# EAGLE schematic adapter_board (EAGLE 9.6.2)
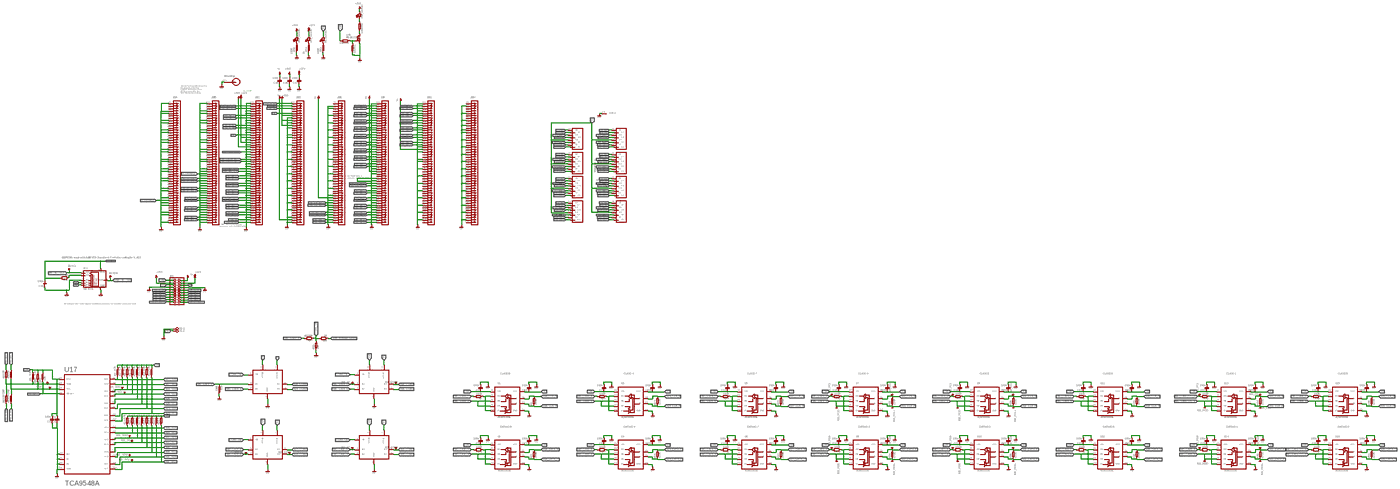
[diagram p0: schematic, sheet 1, overview]
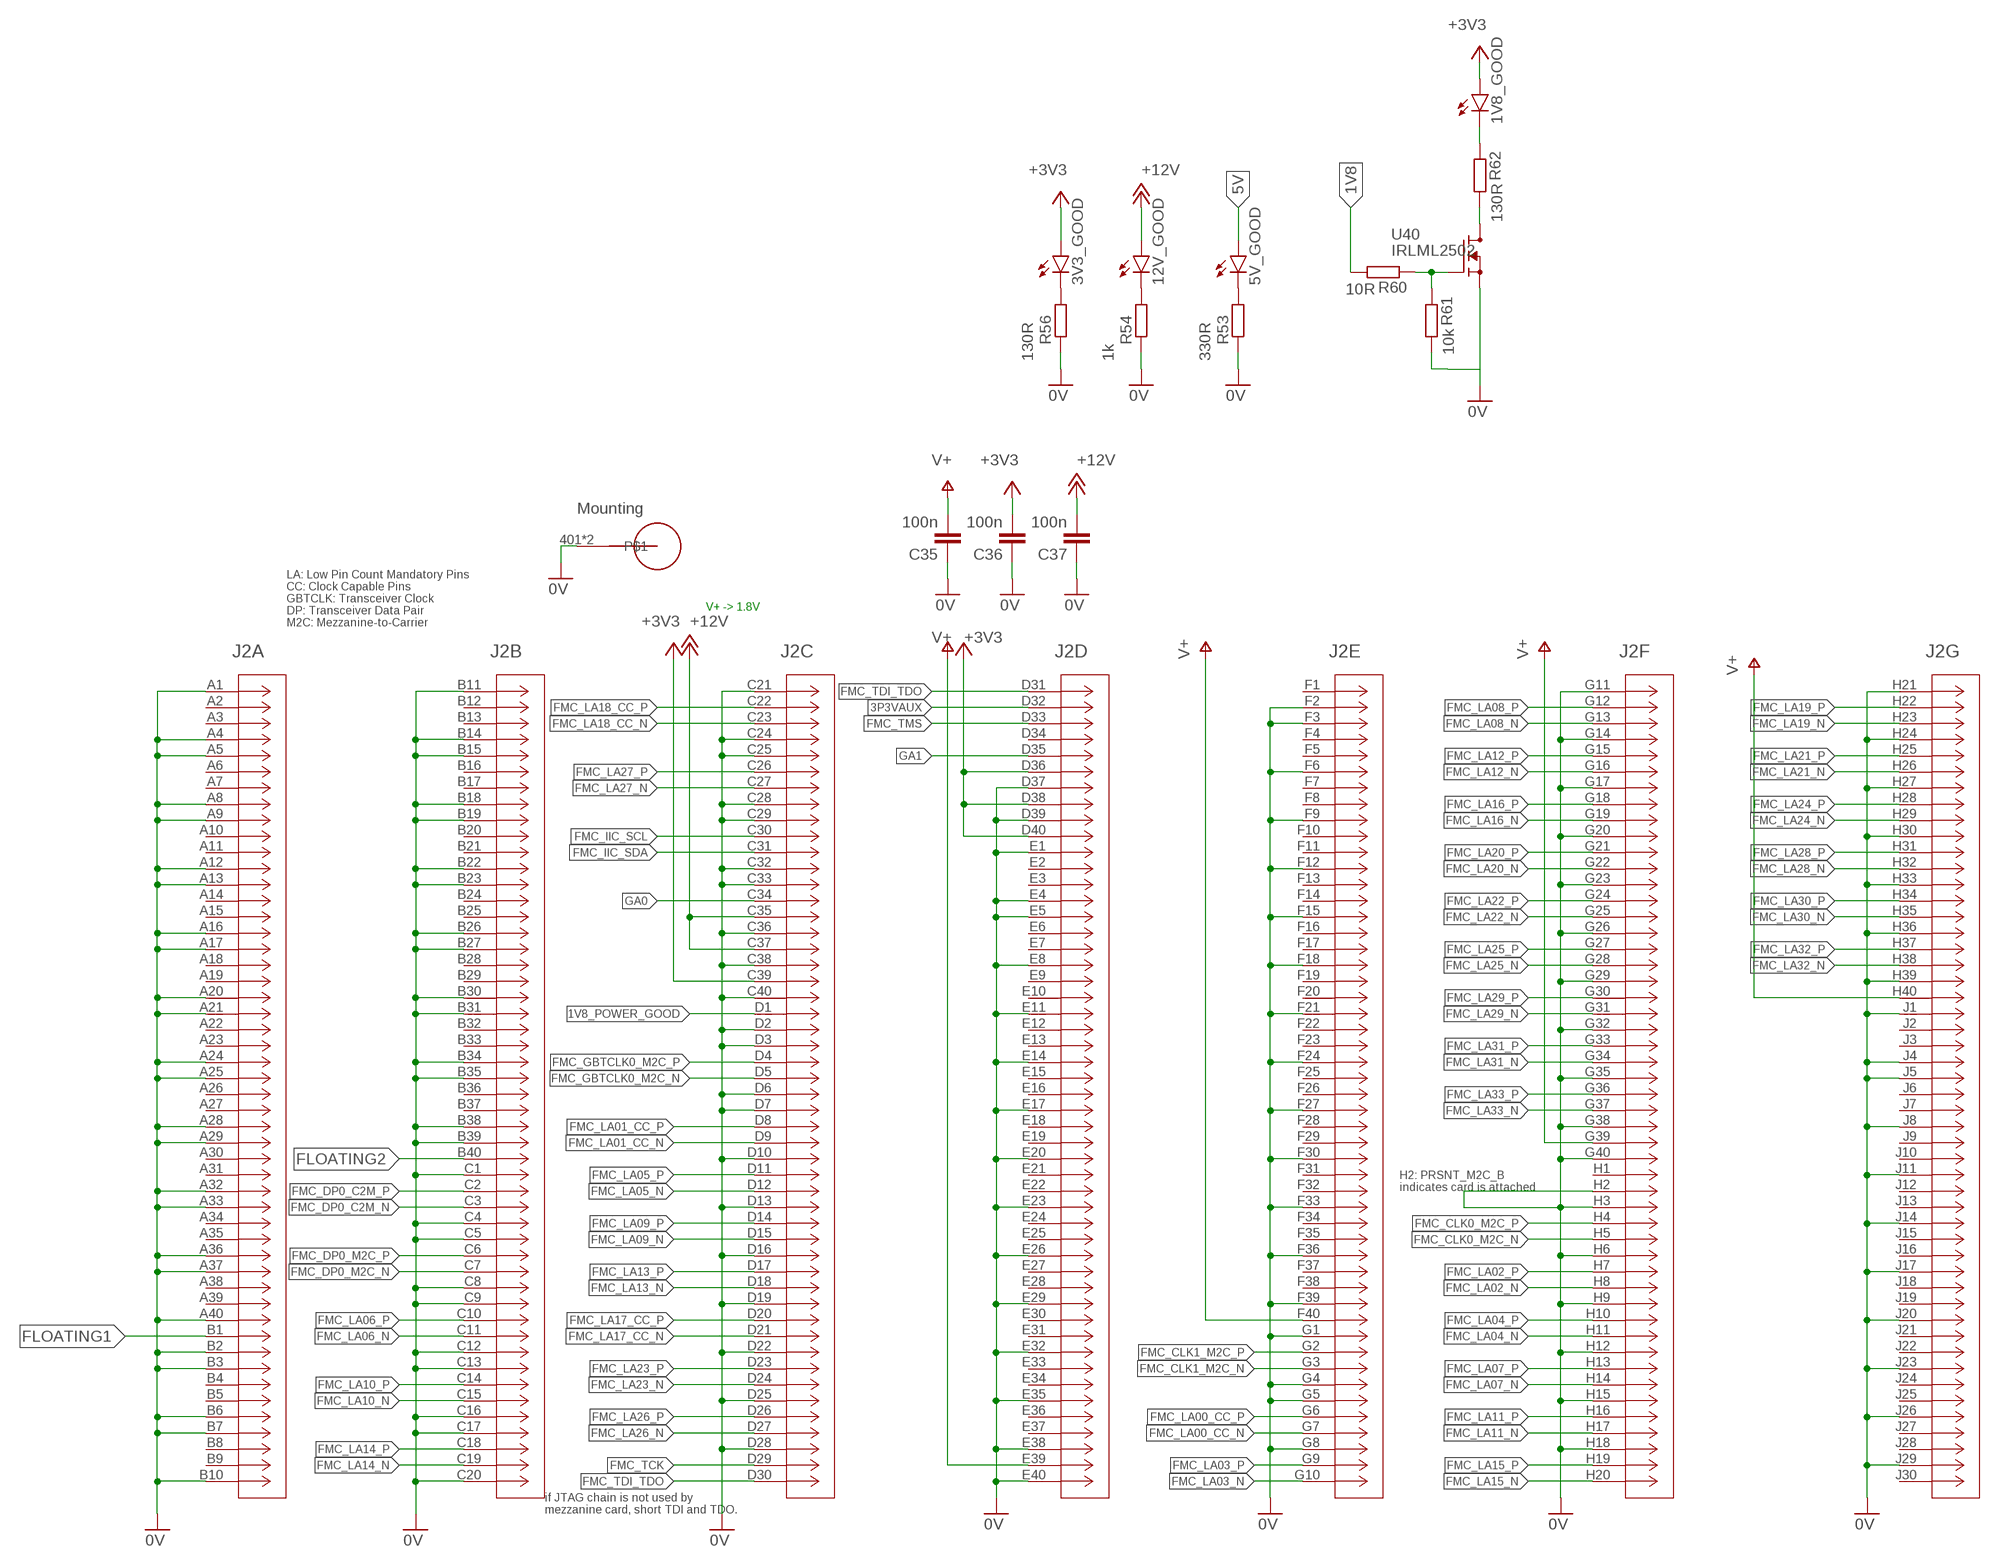
[diagram p1: schematic, sheet 1, part 1 of 5]
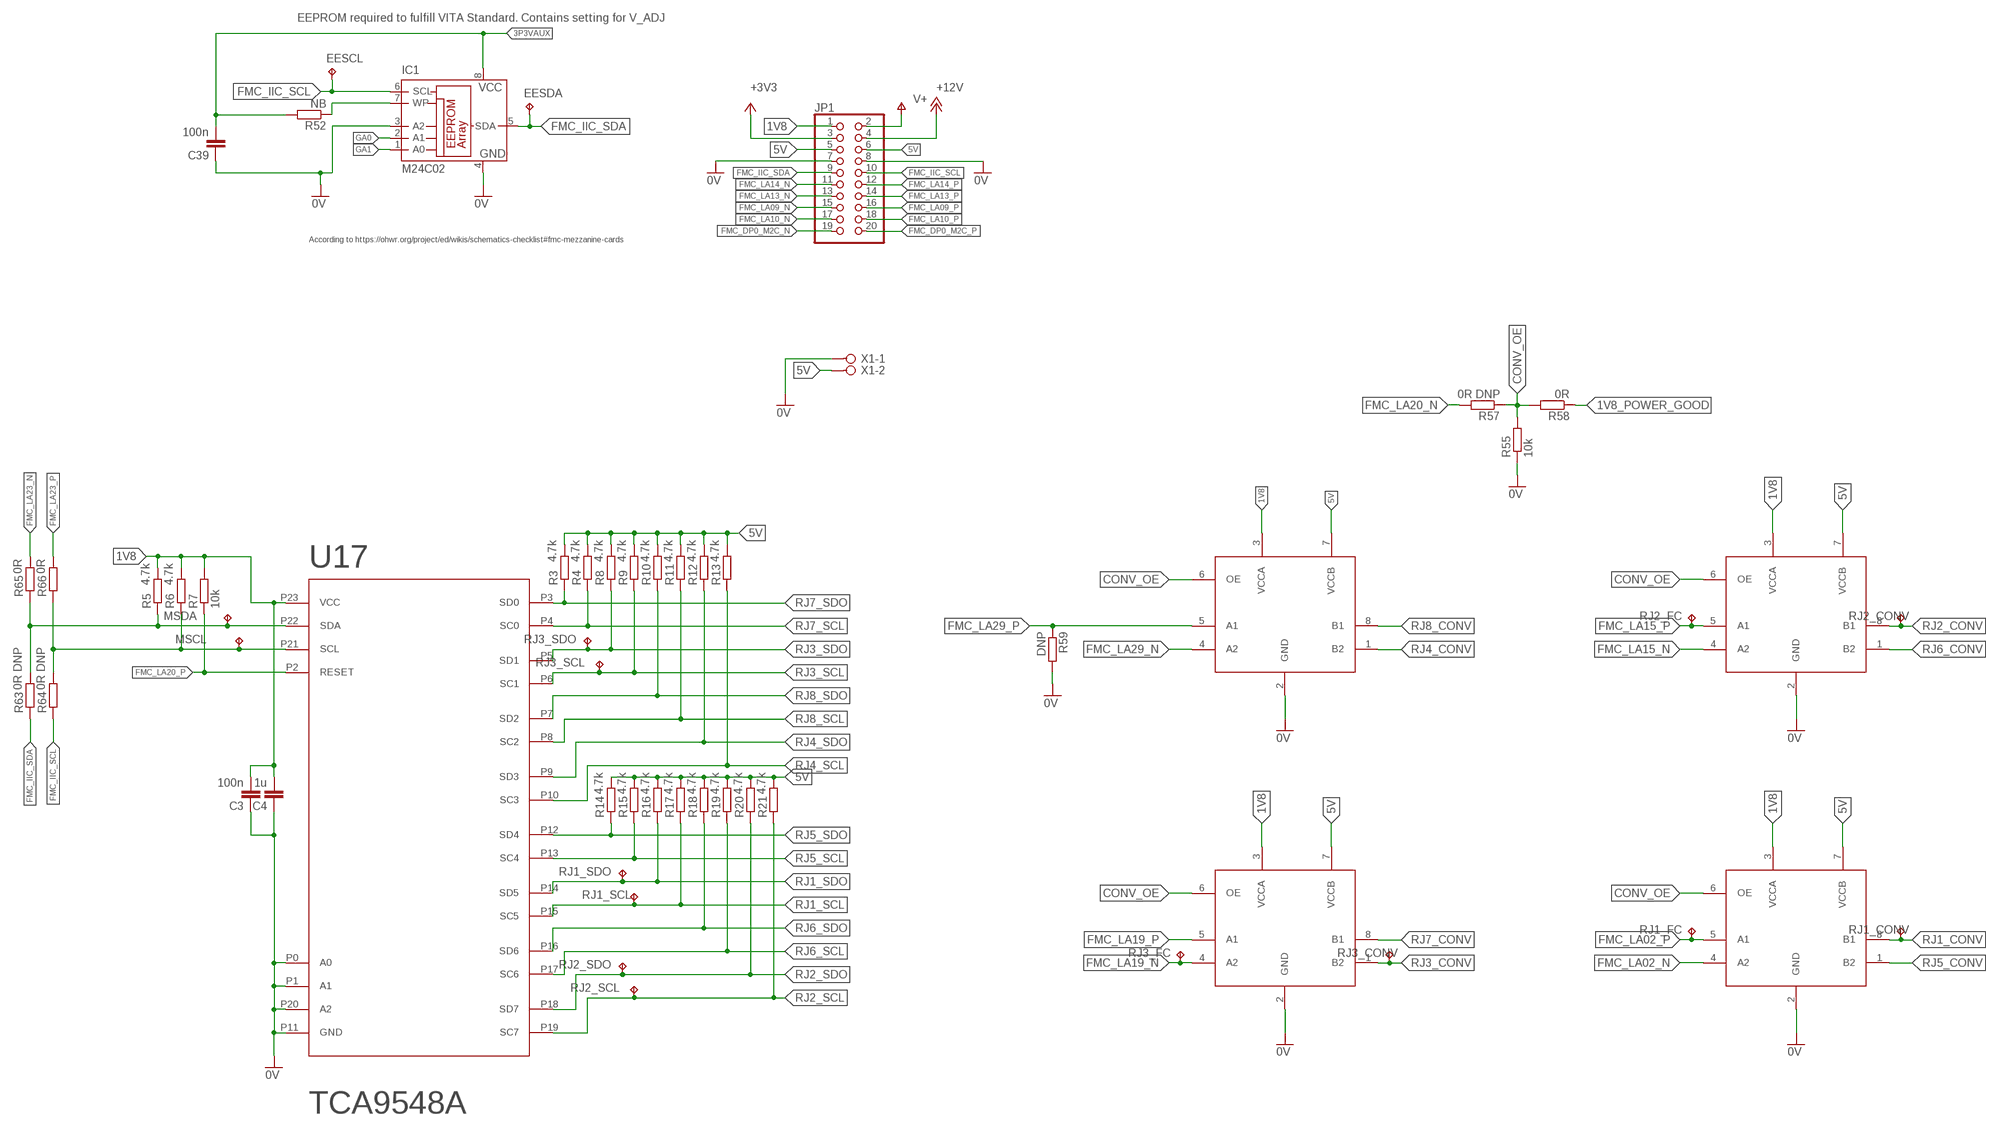
[diagram p2: schematic, sheet 1, part 2 of 5]
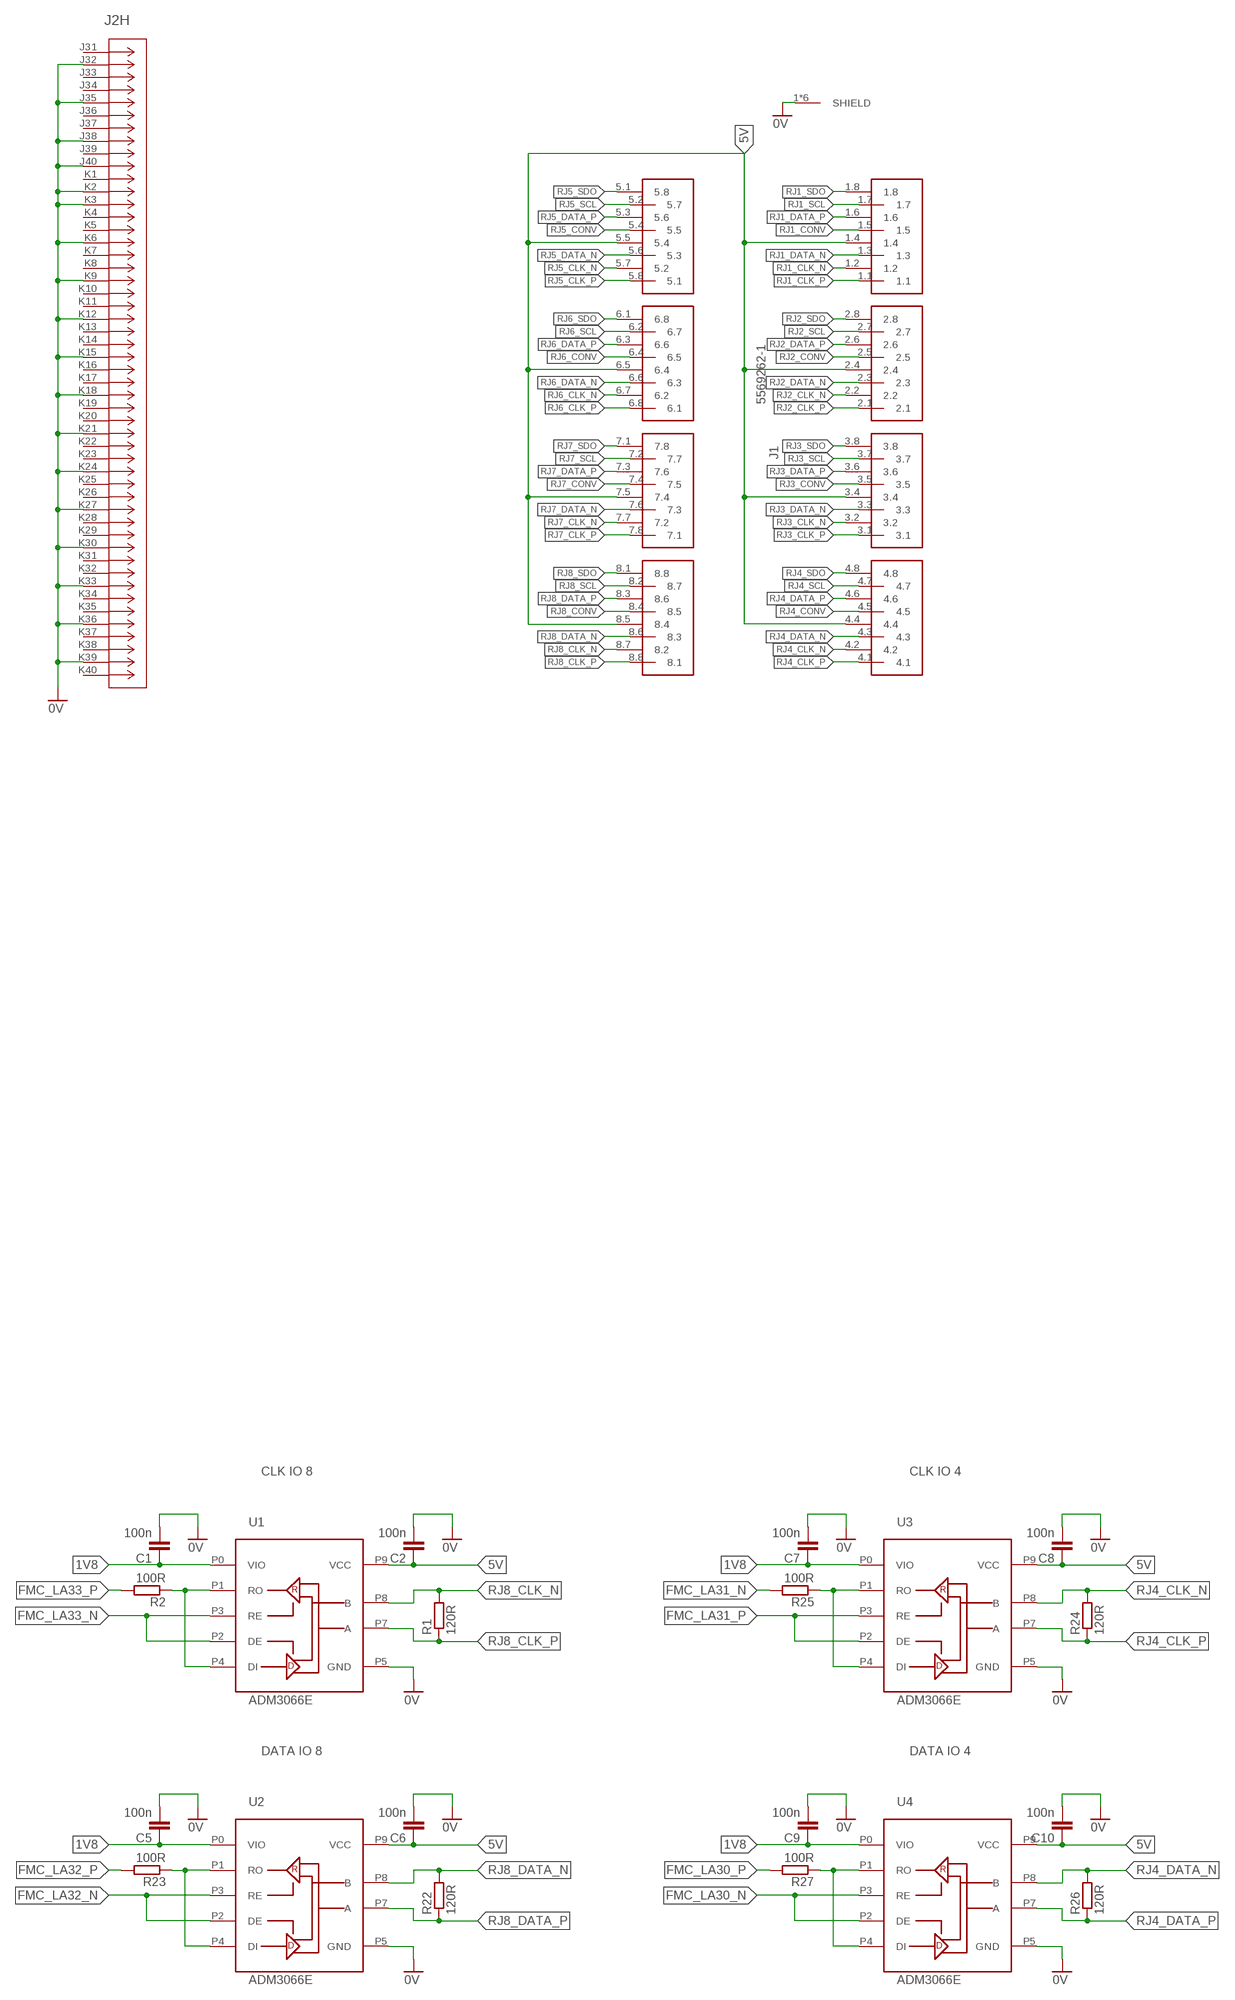
[diagram p3: schematic, sheet 1, part 3 of 5]
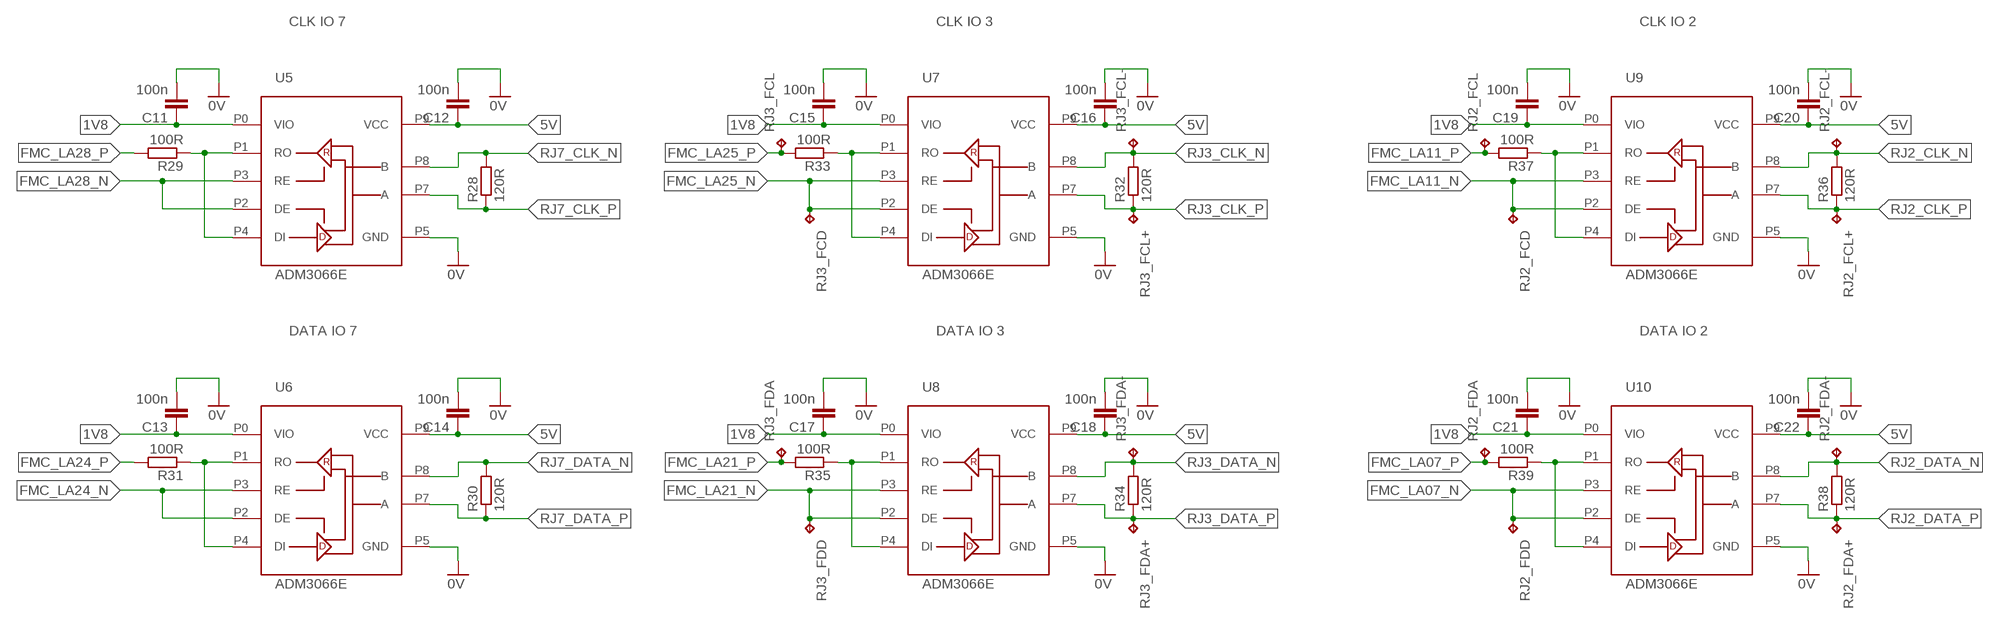
[diagram p4: schematic, sheet 1, part 4 of 5]
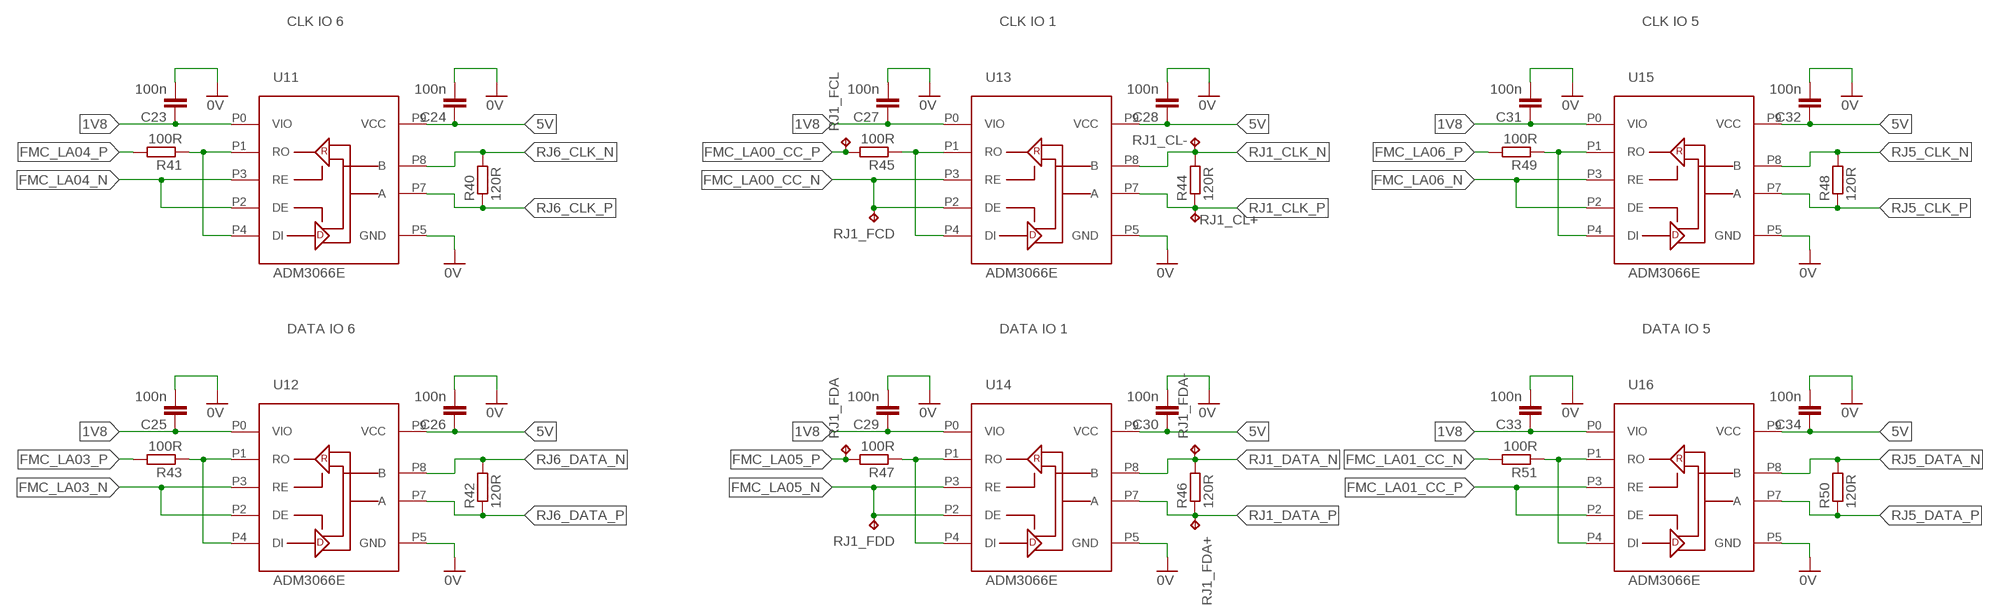
[diagram p5: schematic, sheet 1, part 5 of 5]

## Parts
1V8_GOOD  LEDCHIPLED_0805  [CHIPLED_0805]
3V3_GOOD  LEDCHIPLED_0805  [CHIPLED_0805]
5V_GOOD  LEDCHIPLED_0805  [CHIPLED_0805]
12V_GOOD  LEDCHIPLED_0805  [CHIPLED_0805]
C1  100n  C-EUC0603  [C0603]
C2  100n  C-EUC0603  [C0603]
C3  100n  C-EUC0805  [C0805]
C4  1u  C-EUC0805  [C0805]
C5  100n  C-EUC0603  [C0603]
C6  100n  C-EUC0603  [C0603]
C7  100n  C-EUC0603  [C0603]
C8  100n  C-EUC0603  [C0603]
C9  100n  C-EUC0603  [C0603]
C10  100n  C-EUC0603  [C0603]
C11  100n  C-EUC0603  [C0603]
C12  100n  C-EUC0603  [C0603]
C13  100n  C-EUC0603  [C0603]
C14  100n  C-EUC0603  [C0603]
C15  100n  C-EUC0603  [C0603]
C16  100n  C-EUC0603  [C0603]
C17  100n  C-EUC0603  [C0603]
C18  100n  C-EUC0603  [C0603]
C19  100n  C-EUC0603  [C0603]
C20  100n  C-EUC0603  [C0603]
C21  100n  C-EUC0603  [C0603]
C22  100n  C-EUC0603  [C0603]
C23  100n  C-EUC0603  [C0603]
C24  100n  C-EUC0603  [C0603]
C25  100n  C-EUC0603  [C0603]
C26  100n  C-EUC0603  [C0603]
C27  100n  C-EUC0603  [C0603]
C28  100n  C-EUC0603  [C0603]
C29  100n  C-EUC0603  [C0603]
C30  100n  C-EUC0603  [C0603]
C31  100n  C-EUC0603  [C0603]
C32  100n  C-EUC0603  [C0603]
C33  100n  C-EUC0603  [C0603]
C34  100n  C-EUC0603  [C0603]
C35  100n  C-EUC0603  [C0603]
C36  100n  C-EUC0603  [C0603]
C37  100n  C-EUC0603  [C0603]
C39  100n  C-EUC0603  [C0603]
EESCL  TPB1,27  [B1,27]
EESDA  TPB1,27  [B1,27]
IC1  M24C02  N24C02UDTGTSSOP8  [TSSOP-8]
J1  5569262-1  [TE_5569262-1]
J2  ASP-134488-01  [CONN_ASP-134488-01_SAI]
JP1  PINHD-2X10  [2X10]
MSCL  TPB1,27  [B1,27]
MSDA  TPB1,27  [B1,27]
R1  120R  R-EU_R0805  [R0805]
R2  100R  R-EU_R0603  [R0603]
R3  4.7k  R-EU_R0805  [R0805]
R4  4.7k  R-EU_R0805  [R0805]
R5  4.7k  R-EU_R0603  [R0603]
R6  4.7k  R-EU_R0603  [R0603]
R7  10k  R-EU_R0603  [R0603]
R8  4.7k  R-EU_R0805  [R0805]
R9  4.7k  R-EU_R0805  [R0805]
R10  4.7k  R-EU_R0805  [R0805]
R11  4.7k  R-EU_R0805  [R0805]
R12  4.7k  R-EU_R0805  [R0805]
R13  4.7k  R-EU_R0805  [R0805]
R14  4.7k  R-EU_R0805  [R0805]
R15  4.7k  R-EU_R0805  [R0805]
R16  4.7k  R-EU_R0805  [R0805]
R17  4.7k  R-EU_R0805  [R0805]
R18  4.7k  R-EU_R0805  [R0805]
R19  4.7k  R-EU_R0805  [R0805]
R20  4.7k  R-EU_R0805  [R0805]
R21  4.7k  R-EU_R0805  [R0805]
R22  120R  R-EU_R0805  [R0805]
R23  100R  R-EU_R0603  [R0603]
R24  120R  R-EU_R0805  [R0805]
R25  100R  R-EU_R0603  [R0603]
R26  120R  R-EU_R0805  [R0805]
R27  100R  R-EU_R0603  [R0603]
R28  120R  R-EU_R0805  [R0805]
R29  100R  R-EU_R0603  [R0603]
R30  120R  R-EU_R0805  [R0805]
R31  100R  R-EU_R0603  [R0603]
R32  120R  R-EU_R0805  [R0805]
R33  100R  R-EU_R0603  [R0603]
R34  120R  R-EU_R0805  [R0805]
R35  100R  R-EU_R0603  [R0603]
R36  120R  R-EU_R0805  [R0805]
R37  100R  R-EU_R0603  [R0603]
R38  120R  R-EU_R0805  [R0805]
R39  100R  R-EU_R0603  [R0603]
R40  120R  R-EU_R0805  [R0805]
R41  100R  R-EU_R0603  [R0603]
R42  120R  R-EU_R0805  [R0805]
R43  100R  R-EU_R0603  [R0603]
R44  120R  R-EU_R0805  [R0805]
R45  100R  R-EU_R0603  [R0603]
R46  120R  R-EU_R0805  [R0805]
R47  100R  R-EU_R0603  [R0603]
R48  120R  R-EU_R0805  [R0805]
R49  100R  R-EU_R0603  [R0603]
R50  120R  R-EU_R0805  [R0805]
R51  100R  R-EU_R0603  [R0603]
R52  NB  R-EU_R0603  [R0603]
R53  330R  R-EU_R0805  [R0805]
R54  1k  R-EU_R0805  [R0805]
R55  10k  R-EU_R0603  [R0603]
R56  130R  R-EU_R0805  [R0805]
R57  0R DNP  R-EU_R0603  [R0603]
R58  0R  R-EU_R0603  [R0603]
R59  DNP  R-EU_R0805  [R0805]
R60  10R  R-EU_R0603  [R0603]
R61  10k  R-EU_R0603  [R0603]
R62  130R  R-EU_R0805  [R0805]
R63  0R DNP  R-EU_R0805  [R0805]
R64  0R DNP  R-EU_R0805  [R0805]
R65  0R  R-EU_R0805  [R0805]
R66  0R  R-EU_R0805  [R0805]
RJ1_CL+  TPB1,27  [B1,27]
RJ1_CL-  TPB1,27  [B1,27]
RJ1_CONV  TPB1,27  [B1,27]
RJ1_FC  TPB1,27  [B1,27]
RJ1_FCD  TPB1,27  [B1,27]
RJ1_FCL  TPB1,27  [B1,27]
RJ1_FDA  TPB1,27  [B1,27]
RJ1_FDA+  TPB1,27  [B1,27]
RJ1_FDA-  TPB1,27  [B1,27]
RJ1_FDD  TPB1,27  [B1,27]
RJ1_SCL  TPB1,27  [B1,27]
RJ1_SDO  TPB1,27  [B1,27]
RJ2_CONV  TPB1,27  [B1,27]
RJ2_FC  TPB1,27  [B1,27]
RJ2_FCD  TPB1,27  [B1,27]
RJ2_FCL  TPB1,27  [B1,27]
RJ2_FCL+  TPB1,27  [B1,27]
RJ2_FCL-  TPB1,27  [B1,27]
RJ2_FDA  TPB1,27  [B1,27]
RJ2_FDA+  TPB1,27  [B1,27]
RJ2_FDA-  TPB1,27  [B1,27]
RJ2_FDD  TPB1,27  [B1,27]
RJ2_SCL  TPB1,27  [B1,27]
RJ2_SDO  TPB1,27  [B1,27]
RJ3_CONV  TPB1,27  [B1,27]
RJ3_FC  TPB1,27  [B1,27]
RJ3_FCD  TPB1,27  [B1,27]
RJ3_FCL  TPB1,27  [B1,27]
RJ3_FCL+  TPB1,27  [B1,27]
RJ3_FCL-  TPB1,27  [B1,27]
RJ3_FDA  TPB1,27  [B1,27]
RJ3_FDA+  TPB1,27  [B1,27]
RJ3_FDA-  TPB1,27  [B1,27]
RJ3_FDD  TPB1,27  [B1,27]
RJ3_SCL  TPB1,27  [B1,27]
RJ3_SDO  TPB1,27  [B1,27]
U1  ADM3066E  [MSOP-10]
U2  ADM3066E  [MSOP-10]
U3  ADM3066E  [MSOP-10]
U4  ADM3066E  [MSOP-10]
U5  ADM3066E  [MSOP-10]
U6  ADM3066E  [MSOP-10]
U7  ADM3066E  [MSOP-10]
U8  ADM3066E  [MSOP-10]
U9  ADM3066E  [MSOP-10]
U10  ADM3066E  [MSOP-10]
U11  ADM3066E  [MSOP-10]
U12  ADM3066E  [MSOP-10]
U13  ADM3066E  [MSOP-10]
U14  ADM3066E  [MSOP-10]
U15  ADM3066E  [MSOP-10]
U16  ADM3066E  [MSOP-10]
U17  TCA9548A  PCA9548A  [PCA9548]
U18  TXS0102  [VSSOP-8]
U19  TXS0102  [VSSOP-8]
U20  TXS0102  [VSSOP-8]
U21  TXS0102  [VSSOP-8]
U40  IRLML2502  [SOT23-IRLML]
X1  W237-02P  [W237-132]

## Nets
0V: C1.2 C2.2 C3.1 C4.1 C5.2 C6.2 C7.2 C8.2 C9.2 C10.2 C11.2 C12.2 C13.2 C14.2 C15.2 C16.2 C17.2 C18.2 C19.2 C20.2 C21.2 C22.2 C23.2 C24.2 C25.2 C26.2 C27.2 C28.2 C29.2 C30.2 C31.2 C32.2 C33.2 C34.2 C35.1 C36.1 C37.1 C39.1 IC1.3(A2) IC1.4(GND) J1.1(SHIELD) J1.2(SHIELD) J1.3(SHIELD) J1.4(SHIELD) J1.5(SHIELD) J1.6(SHIELD) J2.401 J2.402 J2.A1(A:A1) J2.A4(A:A4) J2.A5(A:A5) J2.A8(A:A8) J2.A9(A:A9) J2.A12(A:A12) J2.A13(A:A13) J2.A16(A:A16) J2.A17(A:A17) J2.A20(A:A20) J2.A21(A:A21) J2.A24(A:A24) J2.A25(A:A25) J2.A28(A:A28) J2.A29(A:A29) J2.A32(A:A32) J2.A33(A:A33) J2.A36(A:A36) J2.A37(A:A37) J2.A40(A:A40) J2.B2(A:B2) J2.B3(A:B3) J2.B6(A:B6) J2.B7(A:B7) J2.B10(A:B10) J2.B11(B:B11) J2.B14(B:B14) J2.B15(B:B15) J2.B18(B:B18) J2.B19(B:B19) J2.B22(B:B22) J2.B23(B:B23) J2.B26(B:B26) J2.B27(B:B27) J2.B30(B:B30) J2.B31(B:B31) J2.B34(B:B34) J2.B35(B:B35) J2.B38(B:B38) J2.B39(B:B39) J2.C1(B:C1) J2.C4(B:C4) J2.C5(B:C5) J2.C8(B:C8) J2.C9(B:C9) J2.C12(B:C12) J2.C13(B:C13) J2.C16(B:C16) J2.C17(B:C17) J2.C20(B:C20) J2.C21(C:C21) J2.C24(C:C24) J2.C25(C:C25) J2.C28(C:C28) J2.C29(C:C29) J2.C32(C:C32) J2.C33(C:C33) J2.C36(C:C36) J2.C38(C:C38) J2.C40(C:C40) J2.D2(C:D2) J2.D3(C:D3) J2.D6(C:D6) J2.D7(C:D7) J2.D10(C:D10) J2.D13(C:D13) J2.D16(C:D16) J2.D19(C:D19) J2.D22(C:D22) J2.D25(C:D25) J2.D28(C:D28) J2.D37(D:D37) J2.D39(D:D39) J2.E1(D:E1) J2.E4(D:E4) J2.E5(D:E5) J2.E8(D:E8) J2.E11(D:E11) J2.E14(D:E14) J2.E17(D:E17) J2.E20(D:E20) J2.E23(D:E23) J2.E26(D:E26) J2.E29(D:E29) J2.E32(D:E32) J2.E35(D:E35) J2.E38(D:E38) J2.E40(D:E40) J2.F2(E:F2) J2.F3(E:F3) J2.F6(E:F6) J2.F9(E:F9) J2.F12(E:F12) J2.F15(E:F15) J2.F18(E:F18) J2.F21(E:F21) J2.F24(E:F24) J2.F27(E:F27) J2.F30(E:F30) J2.F33(E:F33) J2.F36(E:F36) J2.F39(E:F39) J2.G1(E:G1) J2.G4(E:G4) J2.G5(E:G5) J2.G8(E:G8) J2.G11(F:G11) J2.G14(F:G14) J2.G17(F:G17) J2.G20(F:G20) J2.G23(F:G23) J2.G26(F:G26) J2.G29(F:G29) J2.G32(F:G32) J2.G35(F:G35) J2.G38(F:G38) J2.G40(F:G40) J2.H2(F:H2) J2.H3(F:H3) J2.H6(F:H6) J2.H9(F:H9) J2.H12(F:H12) J2.H15(F:H15) J2.H18(F:H18) J2.H21(G:H21) J2.H24(G:H24) J2.H27(G:H27) J2.H30(G:H30) J2.H33(G:H33) J2.H36(G:H36) J2.H39(G:H39) J2.J1(G:J1) J2.J4(G:J4) J2.J5(G:J5) J2.J8(G:J8) J2.J11(G:J11) J2.J14(G:J14) J2.J17(G:J17) J2.J20(G:J20) J2.J23(G:J23) J2.J26(G:J26) J2.J29(G:J29) J2.J32(H:J32) J2.J35(H:J35) J2.J38(H:J38) J2.J40(H:J40) J2.K2(H:K2) J2.K3(H:K3) J2.K6(H:K6) J2.K9(H:K9) J2.K12(H:K12) J2.K15(H:K15) J2.K18(H:K18) J2.K21(H:K21) J2.K24(H:K24) J2.K27(H:K27) J2.K30(H:K30) J2.K33(H:K33) J2.K36(H:K36) J2.K39(H:K39) JP1.7 JP1.8 R53.1 R54.1 R55.1 R56.1 R59.2 R61.2 U1.P5(GND) U2.P5(GND) U3.P5(GND) U4.P5(GND) U5.P5(GND) U6.P5(GND) U7.P5(GND) U8.P5(GND) U9.P5(GND) U10.P5(GND) U11.P5(GND) U12.P5(GND) U13.P5(GND) U14.P5(GND) U15.P5(GND) U16.P5(GND) U17.P0(A0) U17.P1(A1) U17.P11(GND) U17.P20(A2) U18.2(GND) U19.2(GND) U20.2(GND) U21.2(GND) U40.P2(S) X1.1
1V8: C1.1 C3.2 C4.2 C5.1 C7.1 C9.1 C11.1 C13.1 C15.1 C17.1 C19.1 C21.1 C23.1 C25.1 C27.1 C29.1 C31.1 C33.1 JP1.1 R5.2 R6.2 R7.2 R60.2 U1.P0(VIO) U2.P0(VIO) U3.P0(VIO) U4.P0(VIO) U5.P0(VIO) U6.P0(VIO) U7.P0(VIO) U8.P0(VIO) U9.P0(VIO) U10.P0(VIO) U11.P0(VIO) U12.P0(VIO) U13.P0(VIO) U14.P0(VIO) U15.P0(VIO) U16.P0(VIO) U17.P23(VCC) U18.3(VCCA) U19.3(VCCA) U20.3(VCCA) U21.3(VCCA)
1V8_POWER_GOOD: J2.D1(C:D1) R58.1
3P3VAUX: C39.2 IC1.8(VCC) J2.D32(D:D32) R52.2
5V: 5V_GOOD.A C2.1 C6.1 C8.1 C10.1 C12.1 C14.1 C16.1 C18.1 C20.1 C22.1 C24.1 C26.1 C28.1 C30.1 C32.1 C34.1 J1.1.4 J1.2.4 J1.3.4 J1.4.4 J1.5.5(5.4) J1.6.5(6.4) J1.7.5(7.4) J1.8.5(8.4) JP1.5 JP1.6 R3.2 R4.2 R8.2 R9.2 R10.2 R11.2 R12.2 R13.2 R14.2 R15.2 R16.2 R17.2 R18.2 R19.2 R20.2 R21.2 U1.P9(VCC) U2.P9(VCC) U3.P9(VCC) U4.P9(VCC) U5.P9(VCC) U6.P9(VCC) U7.P9(VCC) U8.P9(VCC) U9.P9(VCC) U10.P9(VCC) U11.P9(VCC) U12.P9(VCC) U13.P9(VCC) U14.P9(VCC) U15.P9(VCC) U16.P9(VCC) U18.7(VCCB) U19.7(VCCB) U20.7(VCCB) U21.7(VCCB) X1.2
+3V3: 1V8_GOOD.A 3V3_GOOD.A C36.2 J2.C39(C:C39) J2.D36(D:D36) J2.D38(D:D38) J2.D40(D:D40) JP1.3
+12V: 12V_GOOD.A C37.2 J2.C35(C:C35) J2.C37(C:C37) JP1.4
CONV_OE: R55.2 R57.1 R58.2 U18.6(OE) U19.6(OE) U20.6(OE) U21.6(OE)
FLOATING1: J2.B1(A:B1)
FLOATING2: J2.B40(B:B40)
FMC_CLK0_M2C_N: J2.H5(F:H5)
FMC_CLK0_M2C_P: J2.H4(F:H4)
FMC_CLK1_M2C_N: J2.G3(E:G3)
FMC_CLK1_M2C_P: J2.G2(E:G2)
FMC_DP0_C2M_N: J2.C3(B:C3)
FMC_DP0_C2M_P: J2.C2(B:C2)
FMC_DP0_M2C_N: J2.C7(B:C7) JP1.19
FMC_DP0_M2C_P: J2.C6(B:C6) JP1.20
FMC_GBTCLK0_M2C_N: J2.D5(C:D5)
FMC_GBTCLK0_M2C_P: J2.D4(C:D4)
FMC_IIC_SCL: EESCL.TP IC1.6(SCL) J2.C30(C:C30) JP1.10 R64.1
FMC_IIC_SDA: EESDA.TP IC1.5(SDA) J2.C31(C:C31) JP1.9 R63.1
FMC_LA00_CC_N: J2.G7(E:G7) RJ1_FCD.TP U13.P2(DE) U13.P3(RE)
FMC_LA00_CC_P: J2.G6(E:G6) R45.2 RJ1_FCL.TP
FMC_LA01_CC_N: J2.D9(C:D9) R51.2
FMC_LA01_CC_P: J2.D8(C:D8) U16.P2(DE) U16.P3(RE)
FMC_LA02_N: J2.H8(F:H8) U21.4(A2)
FMC_LA02_P: J2.H7(F:H7) RJ1_FC.TP U21.5(A1)
FMC_LA03_N: J2.G10(E:G10) U12.P2(DE) U12.P3(RE)
FMC_LA03_P: J2.G9(E:G9) R43.2
FMC_LA04_N: J2.H11(F:H11) U11.P2(DE) U11.P3(RE)
FMC_LA04_P: J2.H10(F:H10) R41.2
FMC_LA05_N: J2.D12(C:D12) RJ1_FDD.TP U14.P2(DE) U14.P3(RE)
FMC_LA05_P: J2.D11(C:D11) R47.2 RJ1_FDA.TP
FMC_LA06_N: J2.C11(B:C11) U15.P2(DE) U15.P3(RE)
FMC_LA06_P: J2.C10(B:C10) R49.2
FMC_LA07_N: J2.H14(F:H14) RJ2_FDD.TP U10.P2(DE) U10.P3(RE)
FMC_LA07_P: J2.H13(F:H13) R39.2 RJ2_FDA.TP
FMC_LA08_N: J2.G13(F:G13)
FMC_LA08_P: J2.G12(F:G12)
FMC_LA09_N: J2.D15(C:D15) JP1.15
FMC_LA09_P: J2.D14(C:D14) JP1.16
FMC_LA10_N: J2.C15(B:C15) JP1.17
FMC_LA10_P: J2.C14(B:C14) JP1.18
FMC_LA11_N: J2.H17(F:H17) RJ2_FCD.TP U9.P2(DE) U9.P3(RE)
FMC_LA11_P: J2.H16(F:H16) R37.2 RJ2_FCL.TP
FMC_LA12_N: J2.G16(F:G16)
FMC_LA12_P: J2.G15(F:G15)
FMC_LA13_N: J2.D18(C:D18) JP1.13
FMC_LA13_P: J2.D17(C:D17) JP1.14
FMC_LA14_N: J2.C19(B:C19) JP1.11
FMC_LA14_P: J2.C18(B:C18) JP1.12
FMC_LA15_N: J2.H20(F:H20) U20.4(A2)
FMC_LA15_P: J2.H19(F:H19) RJ2_FC.TP U20.5(A1)
FMC_LA16_N: J2.G19(F:G19)
FMC_LA16_P: J2.G18(F:G18)
FMC_LA17_CC_N: J2.D21(C:D21)
FMC_LA17_CC_P: J2.D20(C:D20)
FMC_LA18_CC_N: J2.C23(C:C23)
FMC_LA18_CC_P: J2.C22(C:C22)
FMC_LA19_N: J2.H23(G:H23) RJ3_FC.TP U19.4(A2)
FMC_LA19_P: J2.H22(G:H22) U19.5(A1)
FMC_LA20_N: J2.G22(F:G22) R57.2
FMC_LA20_P: J2.G21(F:G21) R7.1 U17.P2(RESET)
FMC_LA21_N: J2.H26(G:H26) RJ3_FDD.TP U8.P2(DE) U8.P3(RE)
FMC_LA21_P: J2.H25(G:H25) R35.2 RJ3_FDA.TP
FMC_LA22_N: J2.G25(F:G25)
FMC_LA22_P: J2.G24(F:G24)
FMC_LA23_N: J2.D24(C:D24) R65.2
FMC_LA23_P: J2.D23(C:D23) R66.2
FMC_LA24_N: J2.H29(G:H29) U6.P2(DE) U6.P3(RE)
FMC_LA24_P: J2.H28(G:H28) R31.2
FMC_LA25_N: J2.G28(F:G28) RJ3_FCD.TP U7.P2(DE) U7.P3(RE)
FMC_LA25_P: J2.G27(F:G27) R33.2 RJ3_FCL.TP
FMC_LA26_N: J2.D27(C:D27)
FMC_LA26_P: J2.D26(C:D26)
FMC_LA27_N: J2.C27(C:C27)
FMC_LA27_P: J2.C26(C:C26)
FMC_LA28_N: J2.H32(G:H32) U5.P2(DE) U5.P3(RE)
FMC_LA28_P: J2.H31(G:H31) R29.2
FMC_LA29_N: J2.G31(F:G31) U18.4(A2)
FMC_LA29_P: J2.G30(F:G30) R59.1 U18.5(A1)
FMC_LA30_N: J2.H35(G:H35) U4.P2(DE) U4.P3(RE)
FMC_LA30_P: J2.H34(G:H34) R27.2
FMC_LA31_N: J2.G34(F:G34) R25.2
FMC_LA31_P: J2.G33(F:G33) U3.P2(DE) U3.P3(RE)
FMC_LA32_N: J2.H38(G:H38) U2.P2(DE) U2.P3(RE)
FMC_LA32_P: J2.H37(G:H37) R23.2
FMC_LA33_N: J2.G37(F:G37) U1.P2(DE) U1.P3(RE)
FMC_LA33_P: J2.G36(F:G36) R2.2
FMC_TCK: J2.D29(C:D29)
FMC_TDI_TDO: J2.D30(C:D30) J2.D31(D:D31)
FMC_TMS: J2.D33(D:D33)
GA0: IC1.2(A1) J2.C34(C:C34)
GA1: IC1.1(A0) J2.D35(D:D35)
I2C_SCL: MSCL.TP R6.1 R64.2 R66.1 U17.P21(SCL)
I2C_SDA: MSDA.TP R5.1 R63.2 R65.1 U17.P22(SDA)
LSIO1: R2.1 U1.P1(RO) U1.P4(DI)
LSIO2: R23.1 U2.P1(RO) U2.P4(DI)
LSIO3: R25.1 U3.P1(RO) U3.P4(DI)
LSIO4: R27.1 U4.P1(RO) U4.P4(DI)
LSIO5: R29.1 U5.P1(RO) U5.P4(DI)
LSIO6: R31.1 U6.P1(RO) U6.P4(DI)
LSIO7: R33.1 U7.P1(RO) U7.P4(DI)
LSIO8: R35.1 U8.P1(RO) U8.P4(DI)
LSIO9: R37.1 U9.P1(RO) U9.P4(DI)
LSIO10: R39.1 U10.P1(RO) U10.P4(DI)
LSIO11: R41.1 U11.P1(RO) U11.P4(DI)
LSIO12: R43.1 U12.P1(RO) U12.P4(DI)
LSIO13: R45.1 U13.P1(RO) U13.P4(DI)
LSIO14: R47.1 U14.P1(RO) U14.P4(DI)
LSIO15: R49.1 U15.P1(RO) U15.P4(DI)
LSIO16: R51.1 U16.P1(RO) U16.P4(DI)
N$1: IC1.7(WP) R52.1
N$2 [FPGA]: 12V_GOOD.C R54.2
N$3 [FPGA]: 3V3_GOOD.C R56.2
N$5 [FPGA]: 5V_GOOD.C R53.2
N$6: R60.1 R61.1 U40.P1(G)
N$8: R62.2 U40.P3(D)
N$9: 1V8_GOOD.C R62.1
RJ1_CLK_N: J1.1.2 R44.2 RJ1_CL-.TP U13.P8(B)
RJ1_CLK_P: J1.1.1 R44.1 RJ1_CL+.TP U13.P7(A)
RJ1_CONV: J1.1.5 RJ1_CONV.TP U21.8(B1)
RJ1_DATA_N: J1.1.3 R46.2 RJ1_FDA-.TP U14.P8(B)
RJ1_DATA_P: J1.1.6 R46.1 RJ1_FDA+.TP U14.P7(A)
RJ1_SCL: J1.1.7 R17.1 RJ1_SCL.TP U17.P15(SC5)
RJ1_SDO: J1.1.8 R16.1 RJ1_SDO.TP U17.P14(SD5)
RJ2_CLK_N: J1.2.2 R36.2 RJ2_FCL-.TP U9.P8(B)
RJ2_CLK_P: J1.2.1 R36.1 RJ2_FCL+.TP U9.P7(A)
RJ2_CONV: J1.2.5 RJ2_CONV.TP U20.8(B1)
RJ2_DATA_N: J1.2.3 R38.2 RJ2_FDA-.TP U10.P8(B)
RJ2_DATA_P: J1.2.6 R38.1 RJ2_FDA+.TP U10.P7(A)
RJ2_SCL: J1.2.7 R21.1 RJ2_SCL.TP U17.P19(SC7)
RJ2_SDO: J1.2.8 R20.1 RJ2_SDO.TP U17.P18(SD7)
RJ3_CLK_N: J1.3.2 R32.2 RJ3_FCL-.TP U7.P8(B)
RJ3_CLK_P: J1.3.1 R32.1 RJ3_FCL+.TP U7.P7(A)
RJ3_CONV: J1.3.5 RJ3_CONV.TP U19.1(B2)
RJ3_DATA_N: J1.3.3 R34.2 RJ3_FDA-.TP U8.P8(B)
RJ3_DATA_P: J1.3.6 R34.1 RJ3_FDA+.TP U8.P7(A)
RJ3_SCL: J1.3.7 R9.1 RJ3_SCL.TP U17.P6(SC1)
RJ3_SDO: J1.3.8 R8.1 RJ3_SDO.TP U17.P5(SD1)
RJ4_CLK_N: J1.4.2 R24.2 U3.P8(B)
RJ4_CLK_P: J1.4.1 R24.1 U3.P7(A)
RJ4_CONV: J1.4.5 U18.1(B2)
RJ4_DATA_N: J1.4.3 R26.2 U4.P8(B)
RJ4_DATA_P: J1.4.6 R26.1 U4.P7(A)
RJ4_SCL: J1.4.7 R13.1 U17.P10(SC3)
RJ4_SDO: J1.4.8 R12.1 U17.P9(SD3)
RJ5_CLK_N: J1.5.7(5.2) R48.2 U15.P8(B)
RJ5_CLK_P: J1.5.8(5.1) R48.1 U15.P7(A)
RJ5_CONV: J1.5.4(5.5) U21.1(B2)
RJ5_DATA_N: J1.5.6(5.3) R50.2 U16.P8(B)
RJ5_DATA_P: J1.5.3(5.6) R50.1 U16.P7(A)
RJ5_SCL: J1.5.2(5.7) R15.1 U17.P13(SC4)
RJ5_SDO: J1.5.1(5.8) R14.1 U17.P12(SD4)
RJ6_CLK_N: J1.6.7(6.2) R40.2 U11.P8(B)
RJ6_CLK_P: J1.6.8(6.1) R40.1 U11.P7(A)
RJ6_CONV: J1.6.4(6.5) U20.1(B2)
RJ6_DATA_N: J1.6.6(6.3) R42.2 U12.P8(B)
RJ6_DATA_P: J1.6.3(6.6) R42.1 U12.P7(A)
RJ6_SCL: J1.6.2(6.7) R19.1 U17.P17(SC6)
RJ6_SDO: J1.6.1(6.8) R18.1 U17.P16(SD6)
RJ7_CLK_N: J1.7.7(7.2) R28.2 U5.P8(B)
RJ7_CLK_P: J1.7.8(7.1) R28.1 U5.P7(A)
RJ7_CONV: J1.7.4(7.5) U19.8(B1)
RJ7_DATA_N: J1.7.6(7.3) R30.2 U6.P8(B)
RJ7_DATA_P: J1.7.3(7.6) R30.1 U6.P7(A)
RJ7_SCL: J1.7.2(7.7) R4.1 U17.P4(SC0)
RJ7_SDO: J1.7.1(7.8) R3.1 U17.P3(SD0)
RJ8_CLK_N: J1.8.7(8.2) R1.2 U1.P8(B)
RJ8_CLK_P: J1.8.8(8.1) R1.1 U1.P7(A)
RJ8_CONV: J1.8.4(8.5) U18.8(B1)
RJ8_DATA_N: J1.8.6(8.3) R22.2 U2.P8(B)
RJ8_DATA_P: J1.8.3(8.6) R22.1 U2.P7(A)
RJ8_SCL: J1.8.2(8.7) R11.1 U17.P8(SC2)
RJ8_SDO: J1.8.1(8.8) R10.1 U17.P7(SD2)
V+: C35.2 J2.E39(D:E39) J2.F40(E:F40) J2.G39(F:G39) J2.H40(G:H40) JP1.2
Unconnected: J2.A2(A:A2) J2.A3(A:A3) J2.A6(A:A6) J2.A7(A:A7) J2.A10(A:A10) J2.A11(A:A11) J2.A14(A:A14) J2.A15(A:A15) J2.A18(A:A18) J2.A19(A:A19) J2.A22(A:A22) J2.A23(A:A23) J2.A26(A:A26) J2.A27(A:A27) J2.A30(A:A30) J2.A31(A:A31) J2.A34(A:A34) J2.A35(A:A35) J2.A38(A:A38) J2.A39(A:A39) J2.B4(A:B4) J2.B5(A:B5) J2.B8(A:B8) J2.B9(A:B9) J2.B12(B:B12) J2.B13(B:B13) J2.B16(B:B16) J2.B17(B:B17) J2.B20(B:B20) J2.B21(B:B21) J2.B24(B:B24) J2.B25(B:B25) J2.B28(B:B28) J2.B29(B:B29) J2.B32(B:B32) J2.B33(B:B33) J2.B36(B:B36) J2.B37(B:B37) J2.D34(D:D34) J2.E2(D:E2) J2.E3(D:E3) J2.E6(D:E6) J2.E7(D:E7) J2.E9(D:E9) J2.E10(D:E10) J2.E12(D:E12) J2.E13(D:E13) J2.E15(D:E15) J2.E16(D:E16) J2.E18(D:E18) J2.E19(D:E19) J2.E21(D:E21) J2.E22(D:E22) J2.E24(D:E24) J2.E25(D:E25) J2.E27(D:E27) J2.E28(D:E28) J2.E30(D:E30) J2.E31(D:E31) J2.E33(D:E33) J2.E34(D:E34) J2.E36(D:E36) J2.E37(D:E37) J2.F1(E:F1) J2.F4(E:F4) J2.F5(E:F5) J2.F7(E:F7) J2.F8(E:F8) J2.F10(E:F10) J2.F11(E:F11) J2.F13(E:F13) J2.F14(E:F14) J2.F16(E:F16) J2.F17(E:F17) J2.F19(E:F19) J2.F20(E:F20) J2.F22(E:F22) J2.F23(E:F23) J2.F25(E:F25) J2.F26(E:F26) J2.F28(E:F28) J2.F29(E:F29) J2.F31(E:F31) J2.F32(E:F32) J2.F34(E:F34) J2.F35(E:F35) J2.F37(E:F37) J2.F38(E:F38) J2.H1(F:H1) J2.J2(G:J2) J2.J3(G:J3) J2.J6(G:J6) J2.J7(G:J7) J2.J9(G:J9) J2.J10(G:J10) J2.J12(G:J12) J2.J13(G:J13) J2.J15(G:J15) J2.J16(G:J16) J2.J18(G:J18) J2.J19(G:J19) J2.J21(G:J21) J2.J22(G:J22) J2.J24(G:J24) J2.J25(G:J25) J2.J27(G:J27) J2.J28(G:J28) J2.J30(G:J30) J2.J31(H:J31) J2.J33(H:J33) J2.J34(H:J34) J2.J36(H:J36) J2.J37(H:J37) J2.J39(H:J39) J2.K1(H:K1) J2.K4(H:K4) J2.K5(H:K5) J2.K7(H:K7) J2.K8(H:K8) J2.K10(H:K10) J2.K11(H:K11) J2.K13(H:K13) J2.K14(H:K14) J2.K16(H:K16) J2.K17(H:K17) J2.K19(H:K19) J2.K20(H:K20) J2.K22(H:K22) J2.K23(H:K23) J2.K25(H:K25) J2.K26(H:K26) J2.K28(H:K28) J2.K29(H:K29) J2.K31(H:K31) J2.K32(H:K32) J2.K34(H:K34) J2.K35(H:K35) J2.K37(H:K37) J2.K38(H:K38) J2.K40(H:K40)

## Notes on the sheet
- V+ -> 1.8V
- LA: Low Pin Count Mandatory Pins
  CC: Clock Capable Pins
  GBTCLK: Transceiver Clock
  DP: Transceiver Data Pair
  M2C: Mezzanine-to-Carrier
- H2: PRSNT_M2C_B 
  indicates card is attached
- if JTAG chain is not used by 
  mezzanine card, short TDI and TDO.
- EEPROM required to fulfill VITA Standard. Contains setting for V_ADJ
- According to https://ohwr.org/project/ed/wikis/schematics-checklist#fmc-mezzanine-cards
- CLK IO 8 | CLK IO 4 | CLK IO 7 | CLK IO 3 | CLK IO 2 | CLK IO 6 | CLK IO 1 | CLK IO 5
- DATA IO 8 | DATA IO 4 | DATA IO 7 | DATA IO 3 | DATA IO 2 | DATA IO 6 | DATA IO 1 | DATA IO 5

## Library data of the parts
1V8_GOOD 3V3_GOOD 5V_GOOD 12V_GOOD = led:LED: LED OSRAM: - CHIPLED LG R971, LG N971, LY N971, LG Q971, LY Q971, LO R971, LY R971 LH N974, LH R974 LS Q976, LO Q976, LY Q976 LO Q996 - Hyper CHIPLED LW Q18S LB Q993, LB Q99A, LB R99A - SideLED LS A670, LO A670, LY A670, LG A670, LP A670 LB A673, LV A673, LT A673, LW A673 LH A674 LY A675 LS A676, LA A676, LO A676, LY A676, LW A676 LS A679, LY A679, LG A679 - Hyper Micro SIDELED® LS Y876, LA Y876, LO Y876, LY Y876 LT Y87S - SmartLED LW L88C, LW L88S LB L89C, LB L89S, LG L890 LS L89K, LO L89K, LY L89K LS L896, LA L896, LO L896, LY L896 - TOPLED LS T670, LO T670, LY T670, LG T670, LP T670 LSG T670, LSP T670, LSY T670, LOP T670, LYG T670 LG T671, LOG T671, LSG T671 LB T673, LV T673, LT T673, LW T673 LH T674 LS T676, LA T676, LO T676, LY T676, LB T676, LH T676, LSB T676, LW T676 LB T67C, LV T67C, LT T67C, LS T67K, LO T67K, LY T67K, LW E67C LS E67B, LA E67B, LO E67B, LY E67B, LB E67C, LV E67C, LT E67C LW T67C LS T679, LY T679, LG T679 LS T770, LO T770, LY T770, LG T770, LP T770 LB T773, LV T773, LT T773, LW T773 LH T774 LS E675, LA E675, LY E675, LS T675 LS T776, LA T776, LO T776, LY T776, LB T776 LHGB T686 LT T68C, LB T68C - Hyper Mini TOPLED® LB M676 - Mini TOPLED Santana® LG M470 LS M47K, LO M47K, LY M47K Source: http://www.osram.convergy.de LUXEON: - LUMILED® LXK2-PW12-R00, LXK2-PW12-S00, LXK2-PW14-U00, LXK2-PW14-V00 LXK2-PM12-R00, LXK2-PM12-S00, LXK2-PM14-U00 LXK2-PE12-Q00, LXK2-PE12-R00, LXK2-PE12-S00, LXK2-PE14-T00, LXK2-PE14-U00 LXK2-PB12-K00, LXK2-PB12-L00, LXK2-PB12-M00, LXK2-PB14-N00, LXK2-PB14-P00, LXK2-PB14-Q00 LXK2-PR12-L00, LXK2-PR12-M00, LXK2-PR14-Q00, LXK2-PR14-R00 LXK2-PD12-Q00, LXK2-PD12-R00, LXK2-PD12-S00 LXK2-PH12-R00, LXK2-PH12-S00 LXK2-PL12-P00, LXK2-PL12-Q00, LXK2-PL12-R00 Source: www.luxeon.com KINGBRIGHT: KA-3528ASYC Source: www.kingbright.com
C1-C37 C39 = rcl:C-EU: CAPACITOR, European symbol; SPICEPREFIX: C
EESCL EESDA MSCL MSDA RJ1_CL+ RJ1_CL- RJ1_CONV RJ1_FC RJ1_FCD RJ1_FCL RJ1_FDA RJ1_FDA+ RJ1_FDA- RJ1_FDD RJ1_SCL RJ1_SDO RJ2_CONV RJ2_FC RJ2_FCD RJ2_FCL RJ2_FCL+ RJ2_FCL- RJ2_FDA RJ2_FDA+ RJ2_FDA- RJ2_FDD RJ2_SCL RJ2_SDO RJ3_CONV RJ3_FC RJ3_FCD RJ3_FCL RJ3_FCL+ RJ3_FCL- RJ3_FDA RJ3_FDA+ RJ3_FDA- RJ3_FDD RJ3_SCL RJ3_SDO = testpad:TP: Test pad
IC1 = parts:N24C02UDTG
J1 = parts:5569262-1: Stacked Modular Jacks; AVAILABILITY: Unavailable; CENTERLINE_PITCH: 1.02 mm[.04 in]; COMMENT: 5569262-1; DESCRIPTION: Conn RJ-45 F 64 POS 2.54mm Solder RA Thru-Hole 64 Terminal 8 Port Cat 5 Tray; EU_ROHS_COMPLIANCE: Compliant; MF: TE Connectivity; MP: 5569262-1; NUMBER_OF_POSITIONS: 8; PACKAGE: None; PRICE: None
J2 = parts:ASP-134488-01; COPYRIGHT: Copyright (C) 2021 Ultra Librarian. All rights reserved.; MANUFACTURER_PART_NUMBER: ASP-134488-01; MFR_NAME: Samtec Inc; SPICEPREFIX: X
JP1 = pinhead:PINHD-2X10: PIN HEADER
R1-R52 R55 R57-R59 R63-R66 = rcl:R-EU_: RESISTOR, European symbol; SPICEPREFIX: R
R53 R54 R56 R60-R62 = resistor:R-EU_: RESISTOR, European symbol
U1-U16 = parts:ADM3066E
U17 = parts:PCA9548A
U18-U21 = parts:TXS0102
U40 = parts:IRLML2502
X1 = con-wago-508:W237-02P: WAGO SREW CLAMP; OC_FARNELL: unknown; OC_NEWARK: unknown

## Net classes
3 FPGA: clearance 0.152 mm to class 0, clearance 7.112 mm to class 1, clearance 3.785 mm to class 2, clearance 0.152 mm